# Altium schematic sheet LED connector.SchDoc
size A4; SheetNumber: 8; SheetTotal: 8
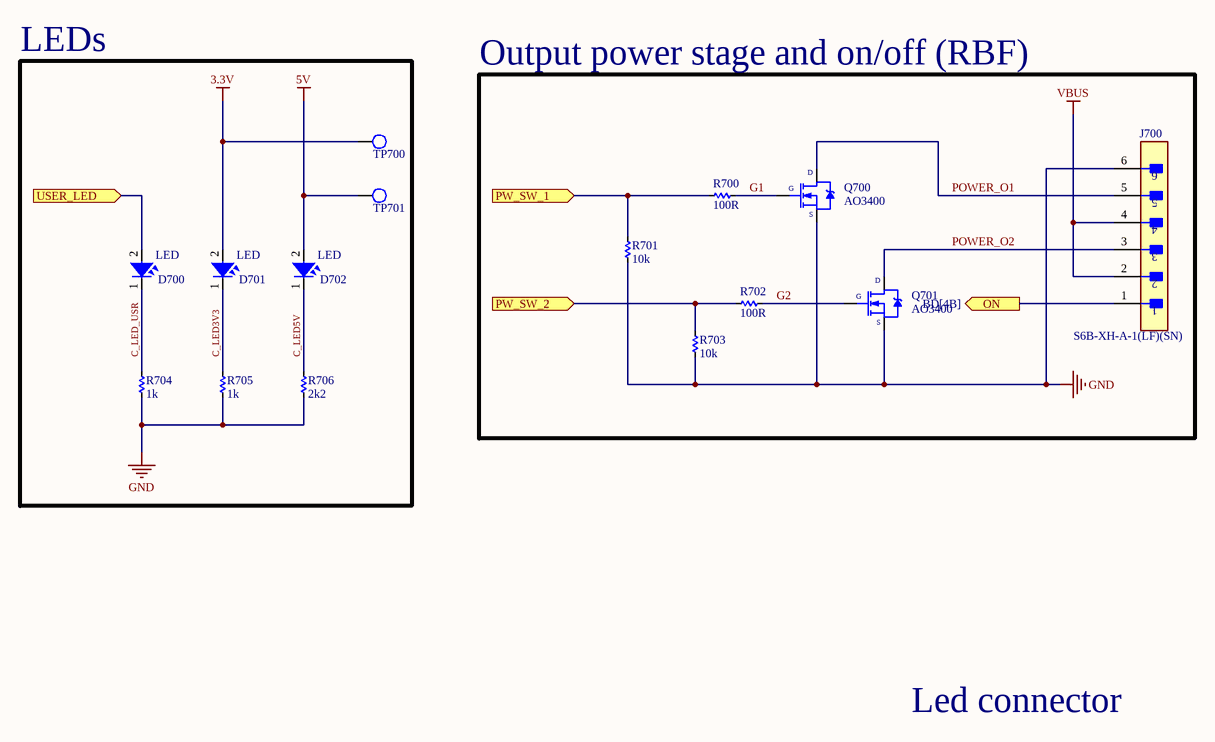
[diagram p0: LED connector.SchDoc]

## Parts
D700  LED  [LED-0805-Green]
D701  LED  [LED-0805-Green]
D702  LED  [LED-0805-Green]
J700  S6B-XH-A-1(LF)(SN)  [FP-S6B-XH-A-1_LF_SN-MFG]
Q700  AO3400  [SOT23-123]
Q701  AO3400  [SOT23-123]
R700  100R  [RES-SMD-0603]
R701  10k  [RES-SMD-0603]
R702  100R  [RES-SMD-0603]
R703  10k  [RES-SMD-0603]
R704  1k  [RES-SMD-0603]
R705  1k  [RES-SMD-0603]
R706  2k2  [RES-SMD-0603]
TP700  Test-Point  [TESTPOINT]  (value not drawn)
TP701  Test-Point  [TESTPOINT]  (value not drawn)

## Blocks framed on the sheet
LEDs: D700-D702 R704-R706 TP700 TP701
Output power stage and on/off (RBF): J700 Q700 Q701 R700-R703

## Ports
ON (out, see BD[4B]), PW_SW_1 (in, see BD[4C], Microcontroller[3C]), PW_SW_2 (in, see BD[4C], Microcontroller[3C]), USER_LED (in, see BD[4C], Microcontroller[3C])

## Nets
3.3V: D701.1 TP700.1
5V: D702.1 TP701.1
GND: J700.6 Q700.3(S) Q701.3(S) R701.2 R703.2 R704.2 R705.2 R706.2
VBUS: J700.2 J700.4
C_LED3V3: D701.2 R705.1
C_LED5V: D702.2 R706.1
C_LED_USR: D700.2 R704.1
G1: Q700.1(G) R700.1
G2: Q701.1(G) R702.1
ON: J700.1 ; port ON
POWER_O1: J700.5 Q700.2(D)
POWER_O2: J700.3 Q701.2(D)
PW_SW_1: R700.2 R701.1 ; port PW_SW_1
PW_SW_2: R702.2 R703.1 ; port PW_SW_2
USER_LED: D700.1 ; port USER_LED

## Notes on the sheet
- (near D700) 1
- (near D700) 2
- (near D701) 1
- (near D701) 2
- (near D702) 1
- (near D702) 2
- Led connector

## Library data of the parts
D700-D702 = LED SMD: Value: LED 3 - 5 ly 2 Colour
J700 = CMP-17439-000023-1: CONN HEADER R/A P6OS 2.5MM; Voltage Rating: 250V; Insulation Resistance: 1GR; Current Rating: 3A; Number of Positions: 6; Gender: Male; Mount: Through Hole; Material: Polyamide; Max Operating Temperature: 85°C; Contact Plating: Tin; Number of Rows: 1; Color: Natural; Termination: Crimp; Min Operating Temperature: -25°C; Pitch: 2.5mm; Lead Free: Lead Free; Contact Material: Brass
Q700 Q701 = AO3400: N-MOS 30V 5.8A
R700-R706 = Res-SMD: Resistor; Manufacturer: Generic Components; Class: Passive; Published: 08/06/2000; Publisher: Altium Hobart Technology Centre